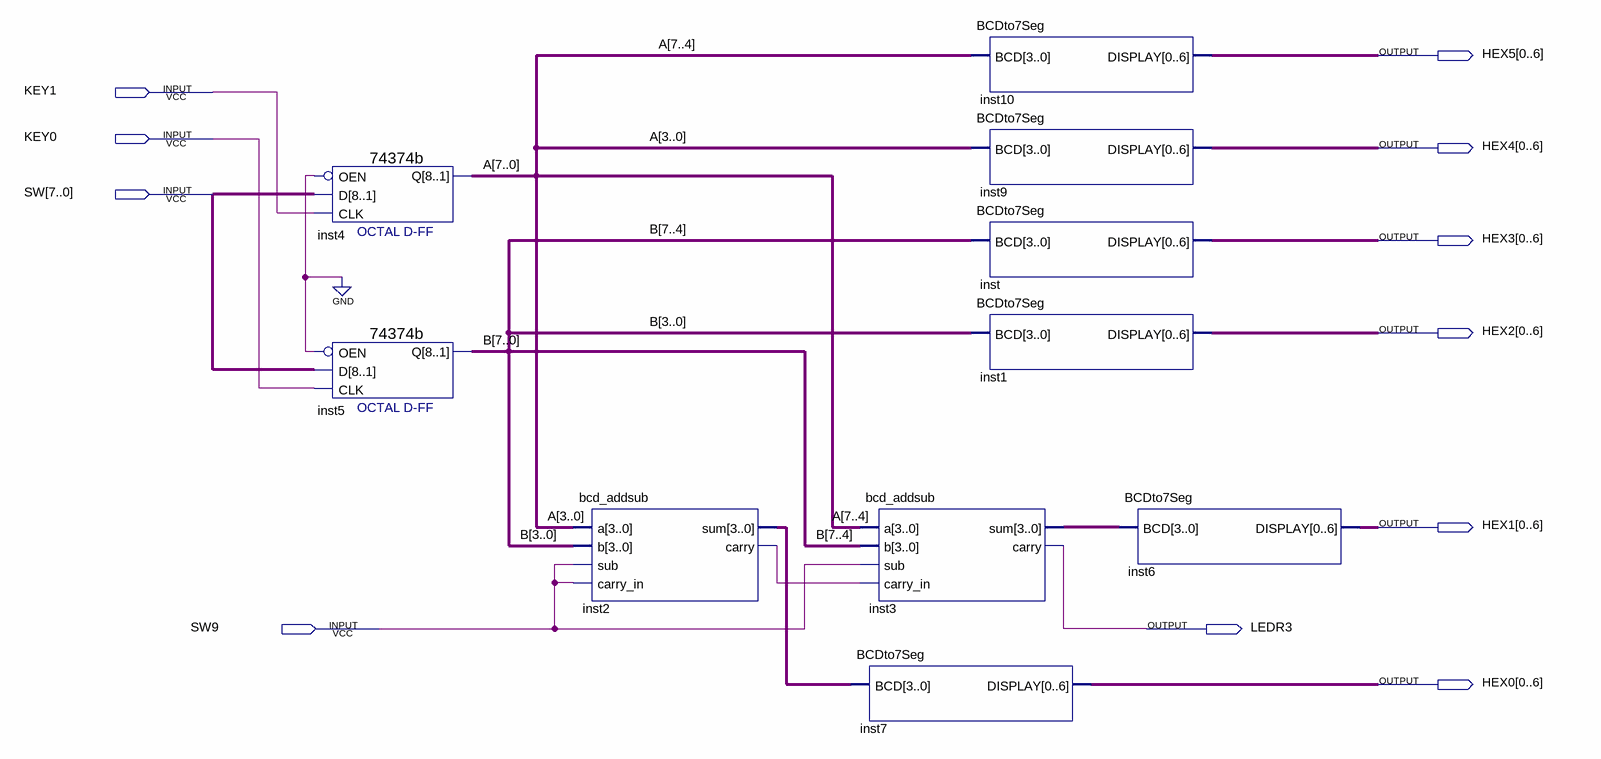
[diagram p0: schematic sheet]
// Quartus schematic Lab22.bdf as structural Verilog: 10 symbols, 11 pins
module Lab22 (
  input  KEY1,
  input  KEY0,
  input  [7:0] SW,
  input  SW9,
  output [0:6] HEX5,
  output [0:6] HEX4,
  output [0:6] HEX3,
  output [0:6] HEX2,
  output [0:6] HEX1,
  output LEDR3,
  output [0:6] HEX0
);

  wire inst2_carry;
  wire [3:0] inst2_sum, inst3_sum;
  wire [7:0] A, B;

  \74374b  inst4 (.D(SW), .OEN(1'b0), .CLK(KEY1), .Q(A));
  \74374b  inst5 (.D(SW), .OEN(1'b0), .CLK(KEY0), .Q(B));
  bcd_addsub inst2 (.a(A[3:0]), .b(B[3:0]), .sub(SW9), .carry_in(SW9), .sum(inst2_sum), .carry(inst2_carry));
  BCDto7Seg inst7 (.BCD(inst2_sum), .DISPLAY(HEX0));
  bcd_addsub inst3 (.a(A[7:4]), .b(B[7:4]), .sub(SW9), .carry_in(inst2_carry), .sum(inst3_sum), .carry(LEDR3));
  BCDto7Seg inst10 (.BCD(A[7:4]), .DISPLAY(HEX5));
  BCDto7Seg inst9 (.BCD(A[3:0]), .DISPLAY(HEX4));
  BCDto7Seg inst (.BCD(B[7:4]), .DISPLAY(HEX3));
  BCDto7Seg inst1 (.BCD(B[3:0]), .DISPLAY(HEX2));
  BCDto7Seg inst6 (.BCD(inst3_sum), .DISPLAY(HEX1));
endmodule
